# EAGLE design Multipurpose-ATX (EAGLE 5.11)
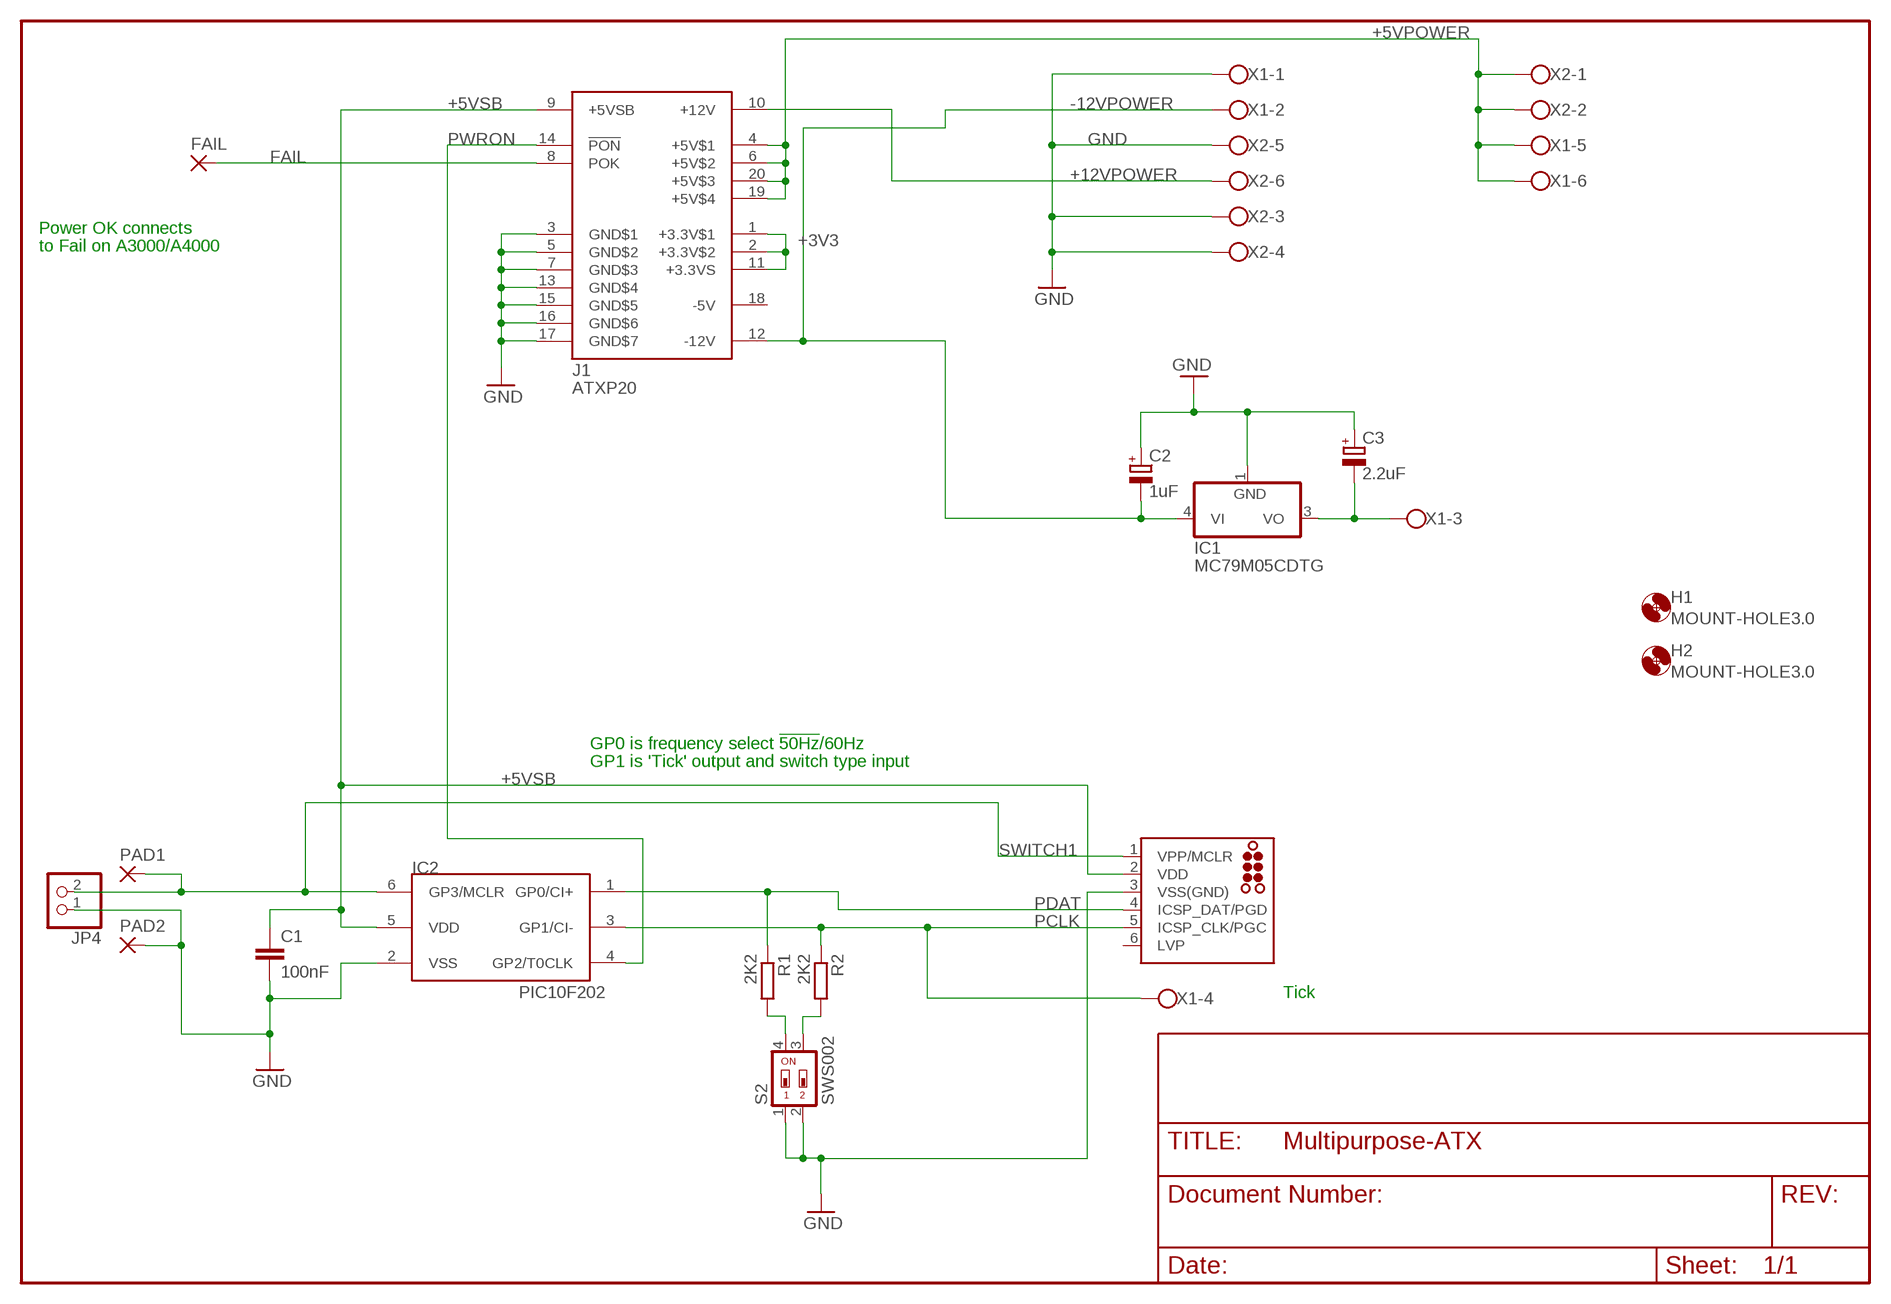
[diagram p0: schematic, sheet 1]

## Parts
C1  100nF  C-EUC0603  [C0603]
C2  1uF  CPOL-EUUD-4X5,8  [UD-4X5,8_NICHICON]
C3  2.2uF  CPOL-EUUD-4X5,8  [UD-4X5,8_NICHICON]
FAIL  3,17/1,3  [3,17/1,3]
H1  MOUNT-HOLE3.0  [3,0]
H2  MOUNT-HOLE3.0  [3,0]
IC1  MC79M05CDTG  MC79M05BDTG  [DPACK_3]
IC2  PIC10F202  PIC10F204OT  [SOT23-6]
J1  ATXP20  [MOLEX39281203]
J2  TC2030-MCP-NL  [TC2030-MCP-NL]
JP4  PINHD-1X2  [1X02]
PAD1  2,54/1,1  [2,54/1,1]
PAD2  2,54/1,1  [2,54/1,1]
R1  2K2  R-EU_R0603  [R0603]
R2  2K2  R-EU_R0603  [R0603]
S2  SWS002  [SMS-002]
X1  W237-6  [W237-6]
X2  W237-6  [W237-6]

## Nets
+3V3: J1.1(+3.3V$1) J1.2(+3.3V$2) J1.11(+3.3VS)
+5VPOWER: J1.4(+5V$1) J1.6(+5V$2) J1.19(+5V$4) J1.20(+5V$3) X1.5 X1.6 X2.1 X2.2
+5VSB: C1.1 IC2.5(VDD) J1.9(+5VSB) J2.2(VDD)
+12VPOWER: J1.10(+12V) X2.6
-12VPOWER: C2.- IC1.4(VI) J1.12(-12V) X1.2
FAIL: FAIL.1(P) J1.8(POK)
GND: C1.2 C2.+ C3.+ IC1.1(GND) IC2.2(VSS) J1.3(GND$1) J1.5(GND$2) J1.7(GND$3) J1.13(GND$4) J1.15(GND$5) J1.16(GND$6) J1.17(GND$7) J2.3(VSS(GND)) JP4.1 PAD2.1(P) S2.1 S2.2 X1.1 X2.3 X2.4 X2.5
N$1: R2.2 S2.3
N$2: R1.2 S2.4
N$3: C3.- IC1.3(VO) X1.3
PCLK: IC2.3(GP1/CI-) J2.5(ICSP_CLK/PGC) R2.1 X1.4
PDAT: IC2.1(GP0/CI+) J2.4(ICSP_DAT/PGD) R1.1
PWRON: IC2.4(GP2/T0CLK) J1.14(!PON)
SWITCH1: IC2.6(GP3/MCLR) J2.1(VPP/MCLR) JP4.2 PAD1.1(P)
Unconnected: J2.6(LVP)

## Notes on the sheet
- Power OK connects
- to Fail on A3000/A4000
- GP0 is frequency select !50Hz!/60Hz
- GP1 is 'Tick' output and switch type input
- Tick

## Power pins joined to a net without a drawn wire
-5VA: J1.18(-5V)

## Library data of the parts
C1 = rcl:C-EU: CAPACITOR, European symbol
C2 C3 = rcl:CPOL-EU: POLARIZED CAPACITOR, European symbol
FAIL = wirepad:3,17/1,3: THROUGH-HOLE PAD
H1 H2 = holes:MOUNT-HOLE: MOUNTING HOLE with drill center marker
IC1 = linear:MC79M: 500 mA Negative Voltage Regulators Source: Data sheet <http://www.onsemi.com/pub_link/Collateral/MC79M00-D.PDF>
IC2 = microchip-5:PIC10F2*: uPC nW 0,25/0,5k Program Flash memory Comparator
J1 = ads4:ATXP20: ATX 20-pin power connector
J2 = tag-connect:TC2030: TAG-CONNECT ICSP Connector Manufacturer: Tag-Connect <http://www.tag-connect.com> Cable for easy In-Circuit Serial Programming. Designed for Microchip ICD2, suitable for many others. Two variants - one "with legs" (for hands-free fit on PCB) and another "without legs" for quick programming. PAD Description 1 MCLR/Vpp 2 Vdd 3 GND 4 PGD (ISPDAT) 5 PGC (ISPCLK) 6 nc (used for LVP) ©2009 ROFA.cz - modified and updated by Robert Darlington ‹rdarlington@gmail.com›
JP4 = pinhead:PINHD-1X2: PIN HEADER
PAD1 PAD2 = wirepad:2,54/1,1: THROUGH-HOLE PAD
R1 R2 = rcl:R-EU_: RESISTOR, European symbol
S2 = smd-special:SWS002: SMD Dip Switch 2 pol.
X1 X2 = con-wago-500:W237-6: WAGO SCREW CLAMP; OC_FARNELL: unknown; OC_NEWARK: unknown

## Board
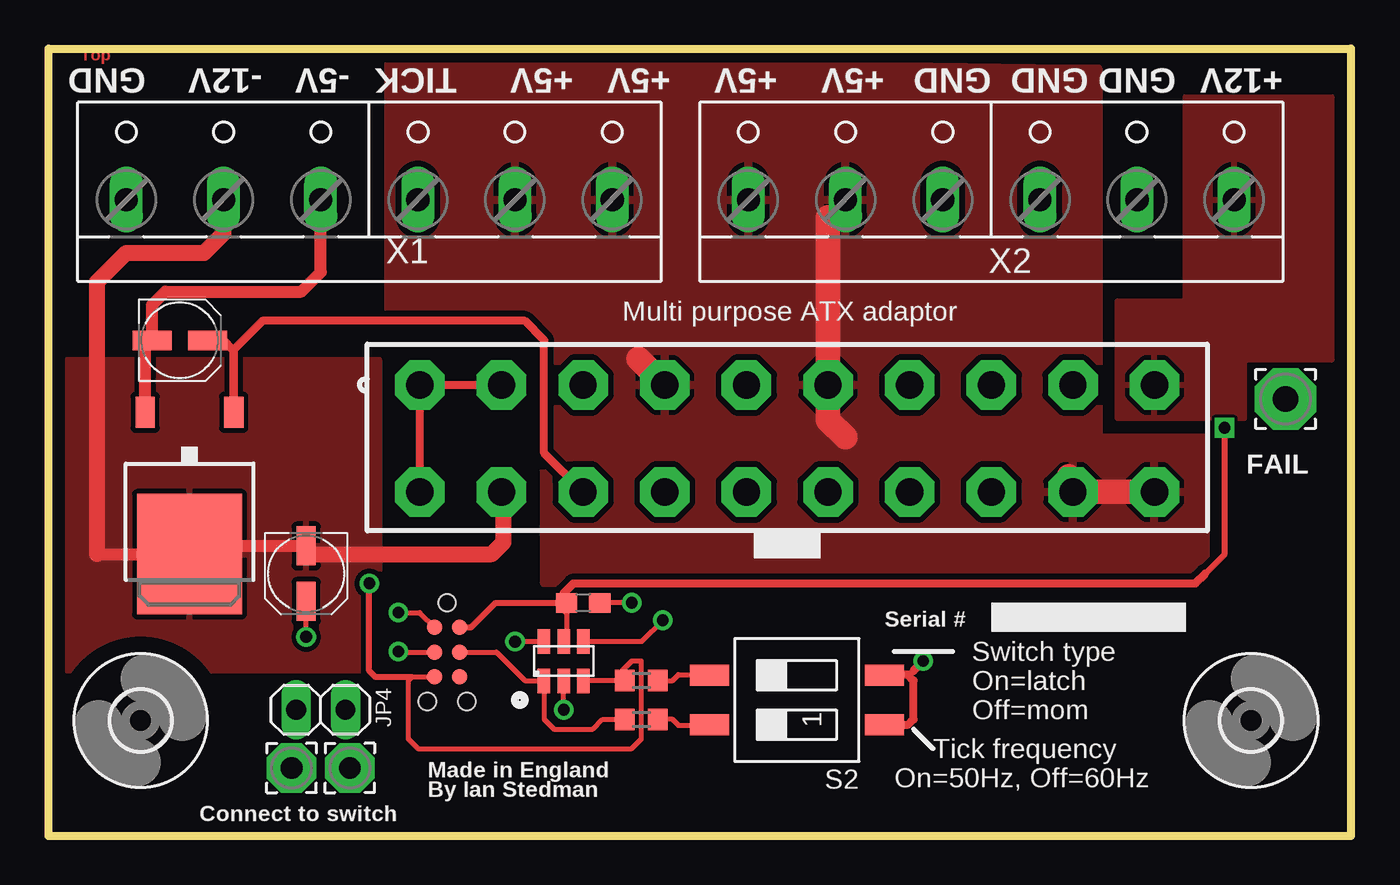
[diagram p1: board, top side]
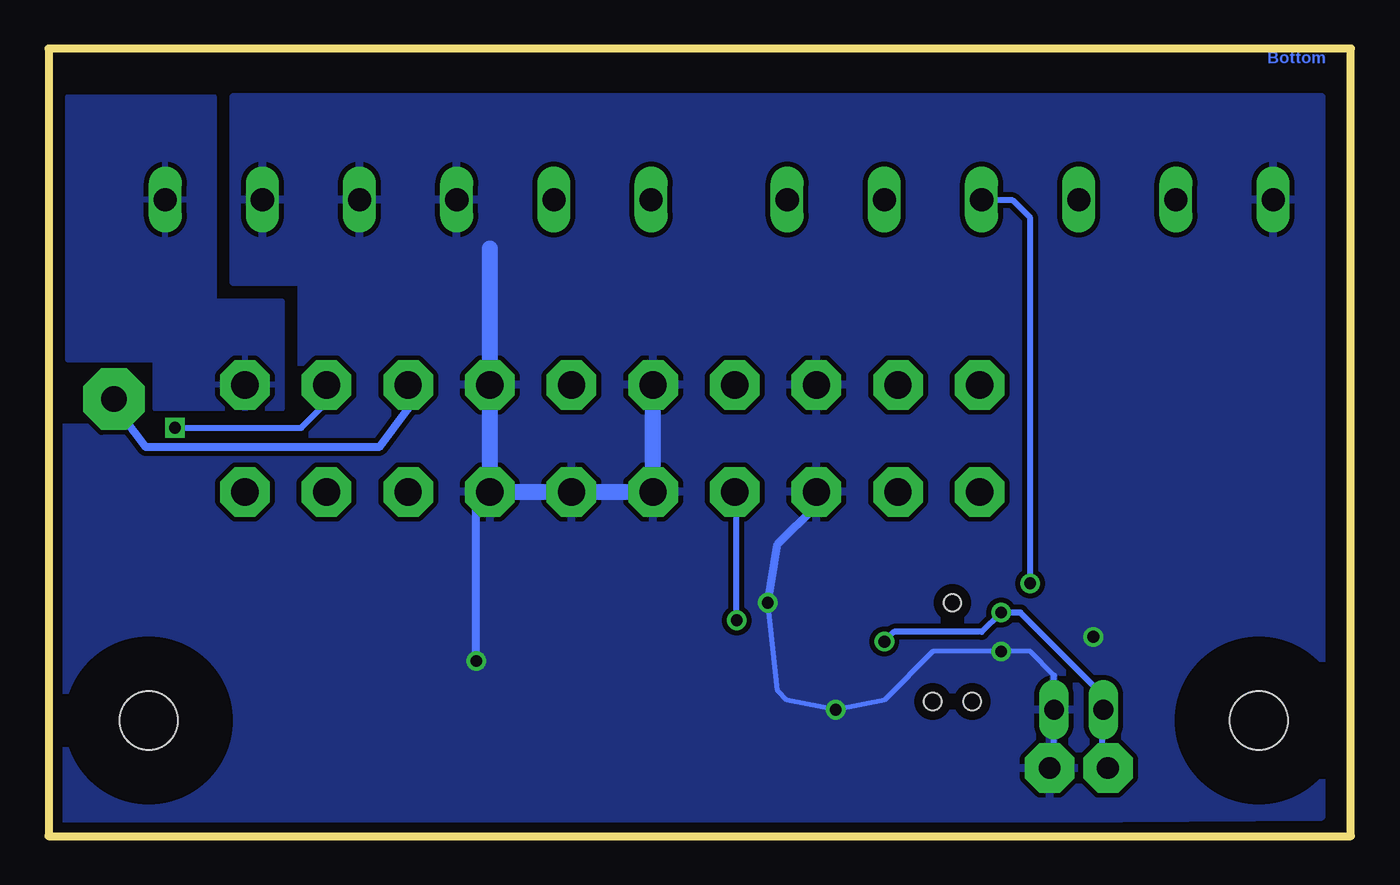
[diagram p2: board, bottom side, seen from below]

Size 67 x 40.5 mm. Coordinates in mm from the lower left corner, seen from the top.
Outline: 0,0 0,40.5 67,40.5 67,0 0,0
Copper layers (1*16): Top 0.035mm / dielectric 1.5mm / Bottom 0.035mm
Design rules "pcbtrainsmt": minimum track width 0.15mm, minimum drill 0.5mm, track to track 0.15mm, track to pad 0.15mm, pad to pad 0.15mm, via to via 0.15mm, smd to smd 0.15mm, copper to edge 0.5mm, drill to drill 0.5mm, minimum pad ring 5mil, minimum via ring 8mil, stop-mask expansion 0mil, vias tented up to drill 0mil, thermal gap 10mil

### Footprints (pad centres in the part's own frame; a part is rotated, then mirrored left to right if it is on the bottom)
C0603 = smd 1.1 x 1: 1 -0.85,0; 2 0.85,0
UD-4X5,8_NICHICON = smd 2 x 1: + 1.425,0; - -1.425,0
3,17/1,3 = drill 1.321 pad 3.175 octagon: 1 0,0
3,0 = hole 3: 0,0
DPACK_3 = smd 1 x 1.6: 1 -2.28,-4.8; 3 2.28,-4.8 | smd 5.4 x 6.2: 4 0,2.5
SOT23-6 = smd 0.635 x 1.27: 1 -1.016,-1.016; 2 0,-1.016; 3 1.016,-1.016; 4 1.016,1.016; 5 0,1.016; 6 -1.016,1.016
MOLEX39281203 = drill 1.4 pad 2.54 octagon: 1 -18.9,2.7; 2 -14.7,2.7; 3 -10.5,2.7; 4 -6.3,2.7; 5 -2.1,2.7; 6 2.1,2.7; 7 6.3,2.7; 8 10.5,2.7; 9 14.7,2.7; 10 18.9,2.7; 11 -18.9,-2.8; 12 -14.7,-2.8; 13 -10.5,-2.8; 14 -6.3,-2.8; 15 -2.1,-2.8; 16 2.1,-2.8; 17 6.3,-2.8; 18 10.5,-2.8; 19 14.7,-2.8; 20 18.9,-2.8
TC2030-MCP-NL = smd 0.787 x 0.787: 1 1.27,-0.635; 2 1.27,0.635; 3 2.54,-0.635; 4 2.54,0.635; 5 3.81,-0.635; 6 3.81,0.635 | hole 0.889: 0,0; 5.08,-1.016; 5.08,1.016
1X02 = drill 1.016 long: 1 -1.27,0; 2 1.27,0
2,54/1,1 = drill 1.118 pad 2.54 octagon: 1 0,0
R0603 = smd 1 x 1.1: 1 -0.85,0; 2 0.85,0
SMS-002 = smd 1.092 x 2.007: 1 -1.27,-4.496; 2 1.27,-4.496; 3 1.27,4.496; 4 -1.27,4.496
W237-6 = drill 1.194 long: 1 -12.5,-1.27; 2 -7.5,-1.27; 3 -2.5,-1.27; 4 2.5,-1.27; 5 7.5,-1.27; 6 12.5,-1.27

### Placement (x,y rotation side)
C1  27.5,12 0 top
C2  13.25,13.5 270 top
C3  6.75,25.5 0 top
FAIL  63.63,22.48 0 top
H1  61.85,5.95 0 top
H2  4.74,5.95 0 top
IC1  7.25,17 180 top
IC2  26.5,9 0 top
J1  38,20.5 0 top
J2  20.5,12 270 top
JP4  14,6.5 180 top
PAD1  12.5,3.5 0 top
PAD2  15.5,3.5 0 top
R1  30.5,6 0 top
R2  30.5,8 0 top
S2  38.5,7 90 top
X1  16.5,34 0 top
X2  48.5,34 0 top

### Tracks (layer width: path | path; a pad name or v marks a point on that pad's centre or on a via)
+3V3
  Top 0.406: J1.11 J1.1 J1.2
+5VPOWER
  Top 1.27: J1.4 30.35,24.55 | 40.1,31.83 J1.6 40.1,21.4 41,20.5 | 52.5,18.5 52.5,17.9 J1.19 J1.20
  pour Top (isolate 0.305): 17.5,40 52.5,39.5 54,39.5 54,20.5 59.5,20.5 59.5,13 25.5,13 25.5,26 17.5,26
+5VSB  (via drill 0.6)
  Top 0.254: 26.5,12.35 C1.1 26.65,11.5 26.65,10.17 IC2.5
  Top 0.305: J2.2 21.73,10.73 23,12 26.15,12 26.65,11.5 | v60.5,21 60.5,14.5 59.5,13.5
  Top 0.406: 59.5,13.5 59,13 27,13 26.5,12.5 26.5,12.15 C1.1
  Bottom 0.305: J1.9 52.7,22.3 54,21 v60.5,21
+12VPOWER
  pour Bottom: 58.5,38 58.5,27.5 55,27.5 55,22 61.5,22 61.5,24.5 66,24.5 66,38
  pour Top: 55,21.5 55,27.5 58.5,27.5 58.5,38 66,38 66,24.5 61.5,24.5 61.5,21.5
-12VPOWER
  Top 0.61: 2.5,14.5 IC1.4 | IC1.4 8,14.5 | 13.68,14.5 C2.- 7.67,14.93 IC1.4
  Top 0.813: 2.5,14.5 2.5,28.5 4,30 7,30 8,30 9,31 X1.2 | J1.12 23.4,17.6 23.4,15.1 22.8,14.5 13.68,14.5
  pour Top (isolate 0.254): 1,24.5 17,24.5 17,8.5 1,8.5
FAIL
  Bottom 0.406: FAIL.1 63.63,22.13 62,20 50,20 48.5,22 J1.8
GND  (via drill 0.6)
  Top 0.15: C2.+ 13.5,12.5
  Top 0.254: J2.3 18.04,9.46 v18,9.5 | v26.5,6.5 IC2.2 | v30,12 C1.2 | v13.25,10.25 C2.+ 13.25,12.25 13.5,12.5 | 13.5,12.5 | 44.3,8.3 44.5,8.5
  Top 0.406: 9.5,25 9.53,24.97 IC1.1 9.5,21.8 9.5,25 | 9.5,25 9,25.5 C3.+ | S2.1 44.23,5.73 44.5,6 44.5,8 44.2,8.3 | 44.2,8.3 43.03,8.3 S2.2 | 44.2,8.3 44.3,8.3 | 44.5,8.5 v45,9 | 9.5,25 11,26.5 24.5,26.5 25.5,25.5 25.5,19.7 J1.13
  Bottom 0.254: 15.27,8.27 16.5,9.5 v18,9.5 21.5,9.5 24,7 v26.5,6.5 29,7 29.5,7.5 v30,12 | v13.25,10.25 13.25,10.15 13.2,10.1
  Bottom 0.305: 15.27,8.27 JP4.1 15.27,3.73 PAD2.1
  Bottom 0.406: J1.13 27.5,17 29.5,15 v30,12 | v45,9 45,17 J1.17
  Bottom 0.813: J1.5 J1.15 J1.16 J1.17 J1.7 44.3,30.23
  pour Bottom (isolate 0.254): 1.5,1 1.5,38 57.5,38 57.5,28.5 54,28.5 54,21 66.5,21 66.5,0.5
N$1
  Top 0.254: R2.2 32.1,8 32.4,8.3 33.97,8.3 S2.3
N$2
  Top 0.254: R1.2 32.1,6 32.4,5.7 33.97,5.7 S2.4
N$3
  Top 0.61: IC1.3 4.97,25.15 C3.- 5.33,27.33 6,28 13,28 14,29 X1.3
PCLK  (via drill 0.6)
  Top 0.254: IC2.3 29.63,7.98 R2.1 29.5,8.15 29.5,8.5 30,9 30.5,9 30.5,5 30,4.5 19,4.5 18.5,5 18.5,8 18.69,8.19 J2.5
  Top 0.305: 18.69,8.19 16.81,8.19 16.5,8.5 v16.5,13
  Bottom 0.305: v16.5,13 16.5,30.23 16.5,31.8 17.4,32.7 18.97,32.7 X1.4
PDAT
  Top 0.254: J2.4 23.04,9.46 24.5,8 25.47,8 IC2.1 25.5,7.97 25.5,6 26,5.5 28,5.5 28.5,6 R1.1
PWRON  (via drill 0.6)
  Top 0.254: IC2.4 30.52,10.02 v31.6,11.1
  Bottom 0.305: v31.6,11.1 31.6,17.6 J1.14
SWITCH1  (via drill 0.6)
  Top 0.254: IC2.6 24.02,10.02 v24,10 | v18,11.5 19.09,11.5 J2.1
  Bottom 0.254: 12.8,6.43 JP4.2
  Bottom 0.305: v24,10 23.5,10.5 19,10.5 v18,11.5 17,11.5 12.73,7.23 JP4.2 | PAD1.1 12.5,4 12.8,4.3 12.8,6.43

### Text on the board
Top: Top
Bottom: Bottom
tPlace: GND | -12V | -5V | TICK | +5V | +5V | +5V | +5V | GND | GND | GND | +12V | Multi purpose ATX adaptor | Serial # | Switch type | On=latch | Off=mom | Tick frequency | By Ian Stedman | Made in England | On=50Hz, Off=60Hz | Connect to switch
Document: IC2
ResistanceTop: 1.9mo 3.0 A | 1.1mo 3.0 A | 3.1mo 2.4 A | 1.3mo 3.0 A | 5.9mo 2.4 A | 1.2mo 2.4 A | 17.0mo 1.9 A | 1.8mo 1.9 A | 1.0mo 1.9 A | 1.5mo 2.4 A | 2.7mo 1.9 A | 5.3mo 1.9 A | 3.5mo 4.0 A | 4.0mo 1.9 A | 4.0mo 1.9 A | 2.8mo 2.4 A | 7.3mo 1.9 A | 6.9mo 1.9 A | 3.6mo 1.9 A | 8.8mo 3.0 A | 1.7mo 4.0 A | 10.9mo 1.5 A | 4.0mo 2.4 A | 4.7mo 2.4 A | 5.8mo 3.0 A | 1.6mo 3.0 A | 2.4mo 1.5 A | 1.2mo 1.5 A | 40.4mo 1.9 A | 1.7mo 953mA | 2.2mo 1.4 A | 2.2mo 1.4 A | 5.3mo 1.5 A | 3.3mo 1.4 A | 3.7mo 1.4 A | 1.0mo 1.5 A | 3.0mo 1.5 A | 1.0mo 1.4 A | 2.7mo 1.4 A | 7.6mo 1.5 A | 3.7mo 1.4 A | 3.8mo 1.4 A | 4.2mo 1.4 A | 3.0mo 1.4 A | 6.1mo 1.4 A | 3.1mo 1.4 A | 3.2mo 1.5 A | 2.4mo 1.4 A | 1.4mo 1.4 A | 1.0mo 1.4 A | 3.2mo 1.4 A | 1.5mo 1.9 A | 2.0mo 1.4 A | 4.3mo 1.4 A | 1.5mo 1.4 A | 1.4mo 1.4 A | 4.0mo 1.4 A | 3.0mo 1.4 A | 8.1mo 1.4 A | 1.4mo 1.4 A | 6.1mo 1.4 A | 4.0mo 1.4 A | 1.4mo 1.4 A | 2.3mo 1.4 A | 1.5mo 1.4 A | 3.2mo 1.4 A | 1.6mo 1.9 A | 2.5mo 1.9 A | 22.2mo 1.4 A | 1.4mo 1.4 A
ResistanceBottom: 18.1mo 4.8 A | 2.6mo 1.5 A | 2.1mo 1.5 A | 2.6mo 1.5 A | 1.4mo 4.8 A | 3.4mo 4.8 A | 1.3mo 4.8 A | 4.4mo 3.0 A | 3.1mo 1.5 A | 3.2mo 1.9 A | 1.5mo 1.9 A | 1.5mo 1.5 A | 29.0mo 1.5 A | 1.2mo 4.8 A | 10.9mo 1.5 A | 3.4mo 1.9 A | 15.1mo 1.9 A | 1.2mo 1.9 A | 2.6mo 3.0 A | 3.5mo 3.0 A | 2.6mo 3.0 A | 3.5mo 3.0 A | 3.6mo 1.9 A | 3.8mo 1.9 A | 10.9mo 1.5 A | 1.7mo 1.5 A | 2.4mo 1.5 A | 10.1mo 1.9 A | 7.6mo 1.5 A | 1.2mo 1.5 A | 3.0mo 1.4 A | 7.1mo 1.4 A | 10.2mo 1.5 A | 3.5mo 1.4 A | 7.1mo 1.4 A | 9.1mo 1.4 A | 3.0mo 1.5 A | 5.1mo 1.4 A | 5.1mo 1.4 A | 1.4mo 1.4 A | 1.2mo 1.5 A | 3.6mo 1.5 A | 4.7mo 1.5 A